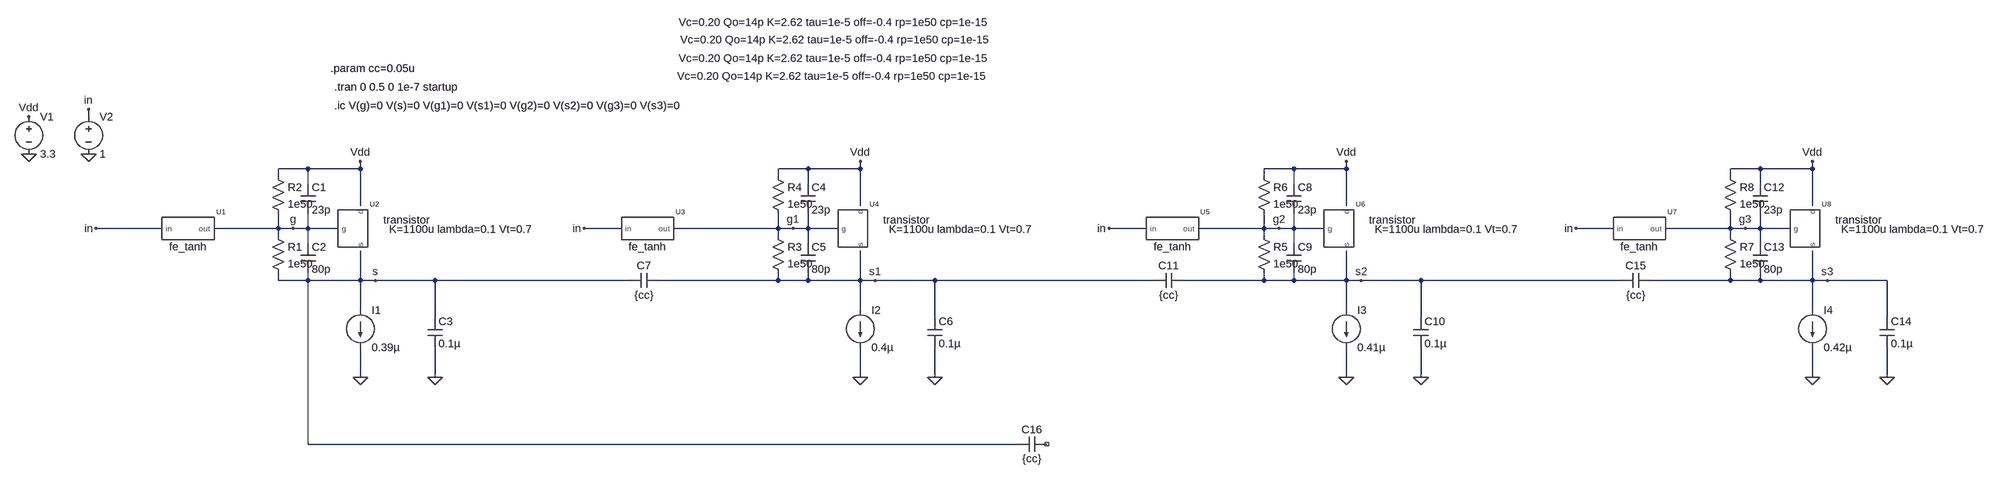
[diagram p0: schematic Oscilador_coupled.asc]
Oscilador_coupled.asc, the LTspice schematic file:
Version 4
SHEET 1 4392 704
WIRE -128 -48 -128 -64
WIRE 576 64 512 64
WIRE 688 64 688 48
WIRE 688 64 576 64
WIRE 1648 64 1584 64
WIRE 1760 64 1760 48
WIRE 1760 64 1648 64
WIRE 2800 64 2736 64
WIRE 2912 64 2912 48
WIRE 2912 64 2800 64
WIRE 3888 64 3824 64
WIRE 4000 64 4000 48
WIRE 4000 64 3888 64
WIRE 512 80 512 64
WIRE 1584 80 1584 64
WIRE 2736 80 2736 64
WIRE 3824 80 3824 64
WIRE 576 96 576 64
WIRE 1648 96 1648 64
WIRE 2800 96 2800 64
WIRE 3888 96 3888 64
WIRE 688 144 688 64
WIRE 1760 144 1760 64
WIRE 2912 144 2912 64
WIRE 4000 144 4000 64
WIRE 176 192 -112 192
WIRE 512 192 512 160
WIRE 512 192 288 192
WIRE 544 192 512 192
WIRE 576 192 576 160
WIRE 576 192 544 192
WIRE 640 192 576 192
WIRE 1248 192 1168 192
WIRE 1584 192 1584 160
WIRE 1584 192 1360 192
WIRE 1616 192 1584 192
WIRE 1648 192 1648 160
WIRE 1648 192 1616 192
WIRE 1712 192 1648 192
WIRE 2400 192 2320 192
WIRE 2736 192 2736 160
WIRE 2736 192 2512 192
WIRE 2768 192 2736 192
WIRE 2800 192 2800 160
WIRE 2800 192 2768 192
WIRE 2864 192 2800 192
WIRE 3488 192 3408 192
WIRE 3824 192 3824 160
WIRE 3824 192 3600 192
WIRE 3856 192 3824 192
WIRE 3888 192 3888 160
WIRE 3888 192 3856 192
WIRE 3952 192 3888 192
WIRE 512 208 512 192
WIRE 1584 208 1584 192
WIRE 2736 208 2736 192
WIRE 3824 208 3824 192
WIRE 576 224 576 192
WIRE 1648 224 1648 192
WIRE 2800 224 2800 192
WIRE 3888 224 3888 192
WIRE 512 304 512 288
WIRE 576 304 576 288
WIRE 576 304 512 304
WIRE 688 304 688 240
WIRE 688 304 576 304
WIRE 720 304 688 304
WIRE 848 304 720 304
WIRE 1264 304 848 304
WIRE 1584 304 1584 288
WIRE 1584 304 1328 304
WIRE 1648 304 1648 288
WIRE 1648 304 1584 304
WIRE 1760 304 1760 240
WIRE 1760 304 1648 304
WIRE 1792 304 1760 304
WIRE 1920 304 1792 304
WIRE 2416 304 1920 304
WIRE 2736 304 2736 288
WIRE 2736 304 2480 304
WIRE 2800 304 2800 288
WIRE 2800 304 2736 304
WIRE 2912 304 2912 240
WIRE 2912 304 2800 304
WIRE 2944 304 2912 304
WIRE 3072 304 2944 304
WIRE 3504 304 3072 304
WIRE 3824 304 3824 288
WIRE 3824 304 3568 304
WIRE 3888 304 3888 288
WIRE 3888 304 3824 304
WIRE 4000 304 4000 240
WIRE 4000 304 3888 304
WIRE 4032 304 4000 304
WIRE 4160 304 4032 304
WIRE 688 368 688 304
WIRE 1760 368 1760 304
WIRE 2912 368 2912 304
WIRE 4000 368 4000 304
WIRE 848 384 848 304
WIRE 1920 384 1920 304
WIRE 3072 384 3072 304
WIRE 4160 384 4160 304
WIRE 688 512 688 448
WIRE 848 512 848 448
WIRE 1760 512 1760 448
WIRE 1920 512 1920 448
WIRE 2912 512 2912 448
WIRE 3072 512 3072 448
WIRE 4000 512 4000 448
WIRE 4160 512 4160 448
WIRE 576 656 576 304
WIRE 2096 656 576 656
FLAG -256 32 0
FLAG -256 -48 Vdd
FLAG 688 48 Vdd
FLAG 688 512 0
FLAG 848 512 0
FLAG -128 32 0
FLAG -112 192 in
FLAG -128 -64 in
FLAG 544 192 g
FLAG 720 304 s
FLAG 1760 48 Vdd
FLAG 1760 512 0
FLAG 1920 512 0
FLAG 1168 192 in
FLAG 1616 192 g1
FLAG 1792 304 s1
FLAG 2912 48 Vdd
FLAG 2912 512 0
FLAG 3072 512 0
FLAG 2320 192 in
FLAG 2768 192 g2
FLAG 2944 304 s2
FLAG 4000 48 Vdd
FLAG 4000 512 0
FLAG 4160 512 0
FLAG 3408 192 in
FLAG 3856 192 g3
FLAG 4032 304 s3
SYMBOL voltage -256 -64 R0
WINDOW 123 0 0 Left 0
WINDOW 39 0 0 Left 0
SYMATTR InstName V1
SYMATTR Value 3.3
SYMBOL cap 560 96 R0
SYMATTR InstName C1
SYMATTR Value 23p
SYMBOL cap 560 224 R0
SYMATTR InstName C2
SYMATTR Value 80p
SYMBOL res 496 192 R0
SYMATTR InstName R1
SYMATTR Value 1e50
SYMBOL res 496 64 R0
SYMATTR InstName R2
SYMATTR Value 1e50
SYMBOL current 688 368 R0
WINDOW 123 0 0 Left 0
WINDOW 39 0 0 Left 0
SYMATTR InstName I1
SYMATTR Value 0.39µ
SYMBOL cap 832 384 R0
SYMATTR InstName C3
SYMATTR Value 0.1µ
SYMBOL voltage -128 -64 R0
WINDOW 123 0 0 Left 0
WINDOW 39 0 0 Left 0
SYMATTR InstName V2
SYMATTR Value 1
SYMBOL fe_tanh 224 192 R0
WINDOW 39 1480 -459 Top 2
SYMATTR SpiceLine Vc=0.20 Qo=14p K=2.62 tau=1e-5 off=-0.4 rp=1e50 cp=1e-15
SYMATTR InstName U1
SYMBOL transistor 672 192 R0
SYMATTR InstName U2
SYMBOL cap 1632 96 R0
SYMATTR InstName C4
SYMATTR Value 23p
SYMBOL cap 1632 224 R0
SYMATTR InstName C5
SYMATTR Value 80p
SYMBOL res 1568 192 R0
SYMATTR InstName R3
SYMATTR Value 1e50
SYMBOL res 1568 64 R0
SYMATTR InstName R4
SYMATTR Value 1e50
SYMBOL current 1760 368 R0
WINDOW 123 0 0 Left 0
WINDOW 39 0 0 Left 0
SYMATTR InstName I2
SYMATTR Value 0.4µ
SYMBOL cap 1904 384 R0
SYMATTR InstName C6
SYMATTR Value 0.1µ
SYMBOL fe_tanh 1296 192 R0
WINDOW 39 411 -421 Top 2
SYMATTR SpiceLine Vc=0.20 Qo=14p K=2.62 tau=1e-5 off=-0.4 rp=1e50 cp=1e-15
SYMATTR InstName U3
SYMBOL transistor 1744 192 R0
SYMATTR InstName U4
SYMBOL cap 1328 288 R90
WINDOW 0 0 32 VBottom 2
WINDOW 3 32 32 VTop 2
SYMATTR InstName C7
SYMATTR Value {cc}
SYMBOL cap 2784 96 R0
SYMATTR InstName C8
SYMATTR Value 23p
SYMBOL cap 2784 224 R0
SYMATTR InstName C9
SYMATTR Value 80p
SYMBOL res 2720 192 R0
SYMATTR InstName R5
SYMATTR Value 1e50
SYMBOL res 2720 64 R0
SYMATTR InstName R6
SYMATTR Value 1e50
SYMBOL current 2912 368 R0
WINDOW 123 0 0 Left 0
WINDOW 39 0 0 Left 0
SYMATTR InstName I3
SYMATTR Value 0.41µ
SYMBOL cap 3056 384 R0
SYMATTR InstName C10
SYMATTR Value 0.1µ
SYMBOL fe_tanh 2448 192 R0
WINDOW 39 -744 -381 Top 2
SYMATTR SpiceLine Vc=0.20 Qo=14p K=2.62 tau=1e-5 off=-0.4 rp=1e50 cp=1e-15
SYMATTR InstName U5
SYMBOL transistor 2896 192 R0
SYMATTR InstName U6
SYMBOL cap 2480 288 R90
WINDOW 0 0 32 VBottom 2
WINDOW 3 32 32 VTop 2
SYMATTR InstName C11
SYMATTR Value {cc}
SYMBOL cap 3872 96 R0
SYMATTR InstName C12
SYMATTR Value 23p
SYMBOL cap 3872 224 R0
SYMATTR InstName C13
SYMATTR Value 80p
SYMBOL res 3808 192 R0
SYMATTR InstName R7
SYMATTR Value 1e50
SYMBOL res 3808 64 R0
SYMATTR InstName R8
SYMATTR Value 1e50
SYMBOL current 4000 368 R0
WINDOW 123 0 0 Left 0
WINDOW 39 0 0 Left 0
SYMATTR InstName I4
SYMATTR Value 0.42µ
SYMBOL cap 4144 384 R0
SYMATTR InstName C14
SYMATTR Value 0.1µ
SYMBOL fe_tanh 3536 192 R0
WINDOW 39 -1836 -343 Top 2
SYMATTR SpiceLine Vc=0.20 Qo=14p K=2.62 tau=1e-5 off=-0.4 rp=1e50 cp=1e-15
SYMATTR InstName U7
SYMBOL transistor 3984 192 R0
SYMATTR InstName U8
SYMBOL cap 3568 288 R90
WINDOW 0 0 32 VBottom 2
WINDOW 3 32 32 VTop 2
SYMATTR InstName C15
SYMATTR Value {cc}
SYMBOL cap 2160 640 R90
WINDOW 0 0 32 VBottom 2
WINDOW 3 32 32 VTop 2
SYMATTR InstName C16
SYMATTR Value {cc}
TEXT 632 -72 Left 2 !.ic V(g)=0 V(s)=0 V(g1)=0 V(s1)=0 V(g2)=0 V(s2)=0 V(g3)=0 V(s3)=0
TEXT 632 -112 Left 2 !.tran 0 0.5 0 1e-7 startup
TEXT 624 -152 Left 2 !.param cc=0.05u

The netlist it stands for:
* Oscilador_coupled.asc
V1 Vdd 0 3.3
C1 Vdd g 23p
C2 g s 80p
R1 g s 1e50
R2 Vdd g 1e50
I1 s 0 0.39µ
C3 s 0 0.1µ
V2 in 0 1
XU1 in g fe_tanh Vc=0.20 Qo=14p K=2.62 tau=1e-5 off=-0.4 rp=1e50 cp=1e-15  ; pins in out
XU2 g Vdd s transistor K=1100u lambda=0.1 Vt=0.7  ; pins g d s
C4 Vdd g1 23p
C5 g1 s1 80p
R3 g1 s1 1e50
R4 Vdd g1 1e50
I2 s1 0 0.4µ
C6 s1 0 0.1µ
XU3 in g1 fe_tanh Vc=0.20 Qo=14p K=2.62 tau=1e-5 off=-0.4 rp=1e50 cp=1e-15  ; pins in out
XU4 g1 Vdd s1 transistor K=1100u lambda=0.1 Vt=0.7  ; pins g d s
C7 s1 s {cc}
C8 Vdd g2 23p
C9 g2 s2 80p
R5 g2 s2 1e50
R6 Vdd g2 1e50
I3 s2 0 0.41µ
C10 s2 0 0.1µ
XU5 in g2 fe_tanh Vc=0.20 Qo=14p K=2.62 tau=1e-5 off=-0.4 rp=1e50 cp=1e-15  ; pins in out
XU6 g2 Vdd s2 transistor K=1100u lambda=0.1 Vt=0.7  ; pins g d s
C11 s2 s1 {cc}
C12 Vdd g3 23p
C13 g3 s3 80p
R7 g3 s3 1e50
R8 Vdd g3 1e50
I4 s3 0 0.42µ
C14 s3 0 0.1µ
XU7 in g3 fe_tanh Vc=0.20 Qo=14p K=2.62 tau=1e-5 off=-0.4 rp=1e50 cp=1e-15  ; pins in out
XU8 g3 Vdd s3 transistor K=1100u lambda=0.1 Vt=0.7  ; pins g d s
C15 s3 s2 {cc}
C16 NC_01 s {cc}
.ic V(g)=0 V(s)=0 V(g1)=0 V(s1)=0 V(g2)=0 V(s2)=0 V(g3)=0 V(s3)=0
.tran 0 0.5 0 1e-7 startup
.param cc=0.05u
.lib C:\Users\MBX\Desktop\Investigacion\Spice-LK-Model\Oscilador_test\fe_tanh_ni.sp
.lib C:\Users\MBX\Desktop\Investigacion\Spice-LK-Model\Oscilador_test\transistor.sp
.backanno
.end